# Altium schematic sheet TRACER_GBOX.SchDoc
size A4
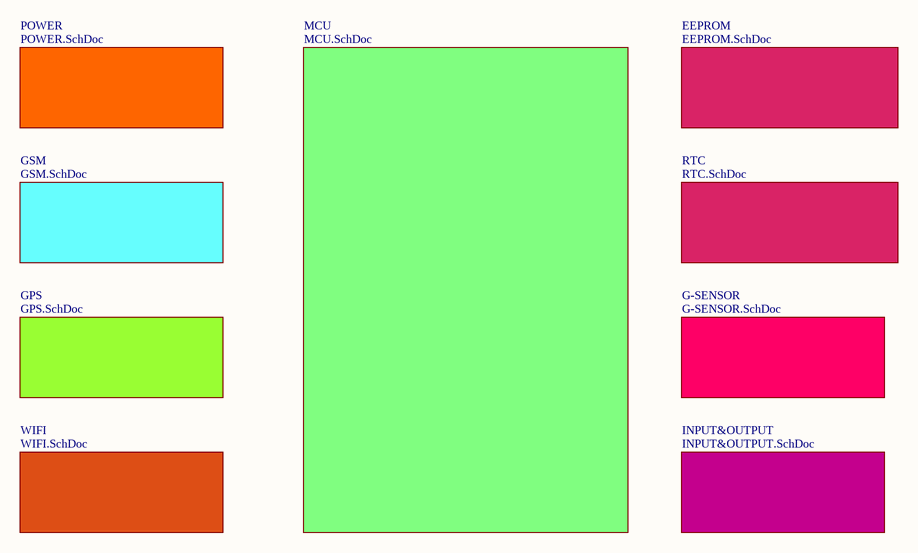
[diagram p0: TRACER_GBOX.SchDoc]

## Sub-sheets
EEPROM = EEPROM.SchDoc: no entries
G-SENSOR = G-SENSOR.SchDoc: no entries
GPS = GPS.SchDoc: no entries
GSM = GSM.SchDoc: no entries
INPUT&OUTPUT = INPUT&OUTPUT.SchDoc: no entries
MCU = MCU.SchDoc: no entries
POWER = POWER.SchDoc: no entries
RTC = RTC.SchDoc: no entries
WIFI = WIFI.SchDoc: no entries